# EAGLE design ghettoduino (EAGLE 5.06)
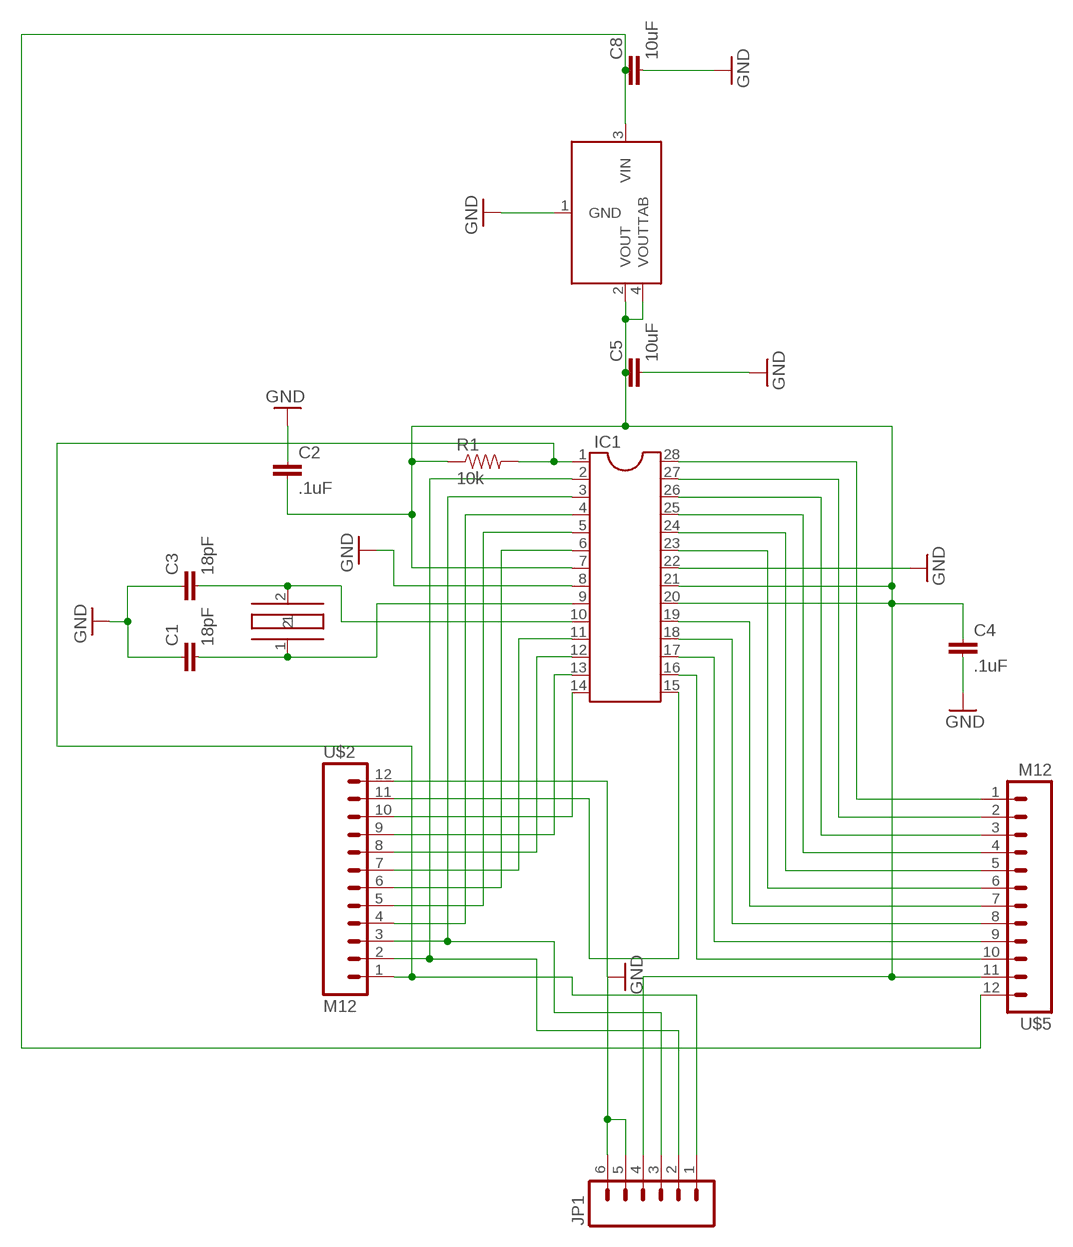
[diagram p0: schematic, sheet 1]

## Parts
5V  ZLDO1117  [ZLDO1117]
C1  18pF  CAP0603-CAP  [0603-CAP]
C2  .1uF  CAP0805  [0805]
C3  18pF  CAP0603-CAP  [0603-CAP]
C4  .1uF  CAP0805  [0805]
C5  10uF  CAP1210  [1210]
C8  10uF  CAP1210  [1210]
IC1  DIL28-3  [DIL28-3]
JP1  M06LOCK  [1X06_LOCK]
R1  10k  RESISTOR  [0805]
U$1  HC49US  [HC49US]
U$2  M12  M12LOCK  [1X12_LOCK]
U$5  M12  M12LOCK  [1X12_LOCK]

## Nets
5V: 5V.2(VOUT) 5V.4(VOUTTAB) C2.2 C4.1 C5.1 IC1.7 IC1.20 IC1.21 JP1.4 R1.1 U$5.11
A0: IC1.23 U$5.6
A1: IC1.24 U$5.5
A2: IC1.25 U$5.4
A3: IC1.26 U$5.3
A4: IC1.27 U$5.2
A5: IC1.28 U$5.1
D0: IC1.2 JP1.2 U$2.2
D1: IC1.3 JP1.3 U$2.3
D2: IC1.4 U$2.4
D3: IC1.5 U$2.5
D4: IC1.6 U$2.6
D5: IC1.11 U$2.7
D6: IC1.12 U$2.8
D7: IC1.13 U$2.9
D8: IC1.14 U$2.10
D9: IC1.15 U$2.11
D10: IC1.16 U$5.10
D11: IC1.17 U$5.9
D12: IC1.18 U$5.8
D13: IC1.19 U$5.7
GND: 5V.1(GND) C1.1 C2.1 C3.1 C4.2 C5.2 C8.2 IC1.8 IC1.22 JP1.5 JP1.6 U$2.12
N$1: C3.2 IC1.10 U$1.2
N$3: C1.2 IC1.9 U$1.1
RESET: IC1.1 JP1.1 R1.2 U$2.1
VIN: 5V.3(VIN) C8.1 U$5.12

## Library data of the parts
5V = 1dah:ZLDO1117
C1-C5 C8 = 1dah:CAP: Capacitor Standard 0402 ceramic capacitor, and 0.1" leaded capacitor.
IC1 = 1dah:DIL28: Dual In Line
JP1 = 1dah:M06: Header 6 Standard 6-pin 0.1" header. Use with straight break away headers (SKU : PRT-00116), right angle break away headers (PRT-00553), swiss pins (PRT-00743), machine pins (PRT-00117), and female headers (PRT-00115). Molex polarized connector foot print use with SKU : PRT-08094 with associated crimp pins and housings. NOTES ON THE VARIANTS LOCK and LOCK_LONGPADS... This footprint was designed to help hold the alignment of a through-hole component (i.e. 6-pin header) while soldering it into place. You may notice that each hole has been shifted either up or down by 0.005 of an inch from it's more standard position (which is a perfectly straight line). This slight alteration caused the pins (the squares in the middle) to touch the edges of the holes. Because they are alternating, it causes a "brace" to hold the component in place. 0.005 has proven to be the perfect amount of "off-center" position when using our standard breakaway headers. Although looks a little odd when you look at the bare footprint, once you have a header in there, the alteration is very hard to notice. Also, if you push a header all the way into place, it is covered up entirely on the bottom side. This idea of altering the position of holes to aid alignment will be further integrated into the Sparkfun Library for other footprints. It can help hold any component with 3 or more connection pins.
R1 = 1dah:RESISTOR: Resistor Basic schematic elements and footprints for 0603, 1206, and PTH 1/10th watt (small) resistors.
U$1 = 1dah:HC49US: 16 MHz crystal
U$2 U$5 = 1dah:M12: Header 12 Standard 12-pin 0.1" header. Use with straight break away headers (SKU : PRT-00116), right angle break away headers (PRT-00553), swiss pins (PRT-00743), machine pins (PRT-00117), and female headers (PRT-00115).

## Board
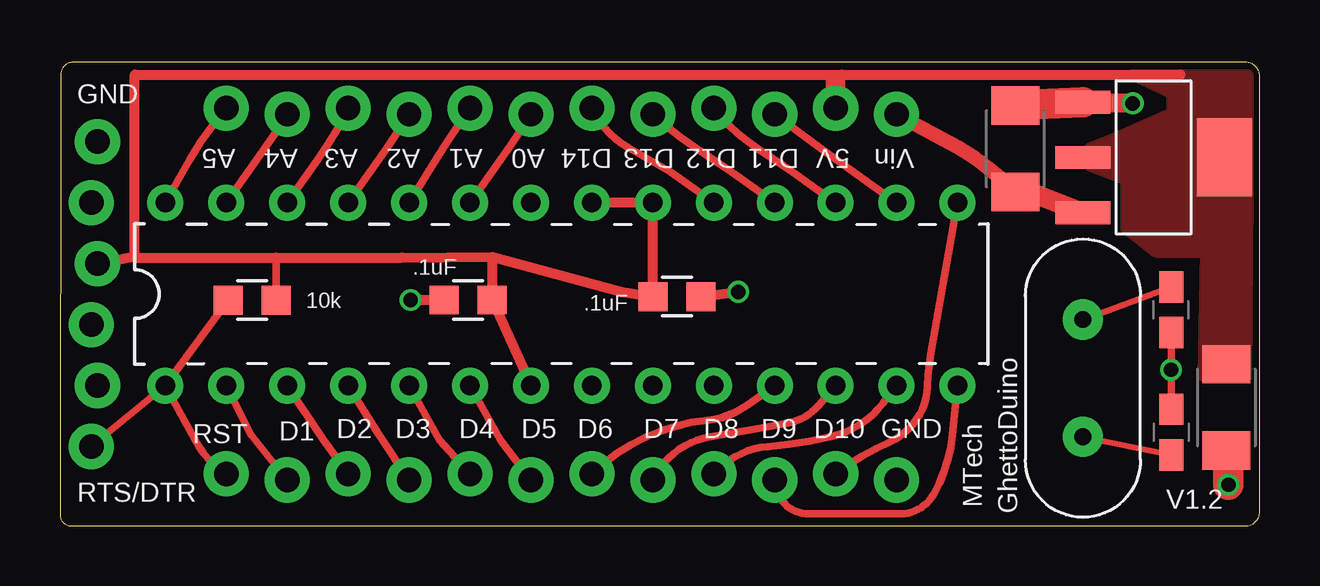
[diagram p1: board, top side]
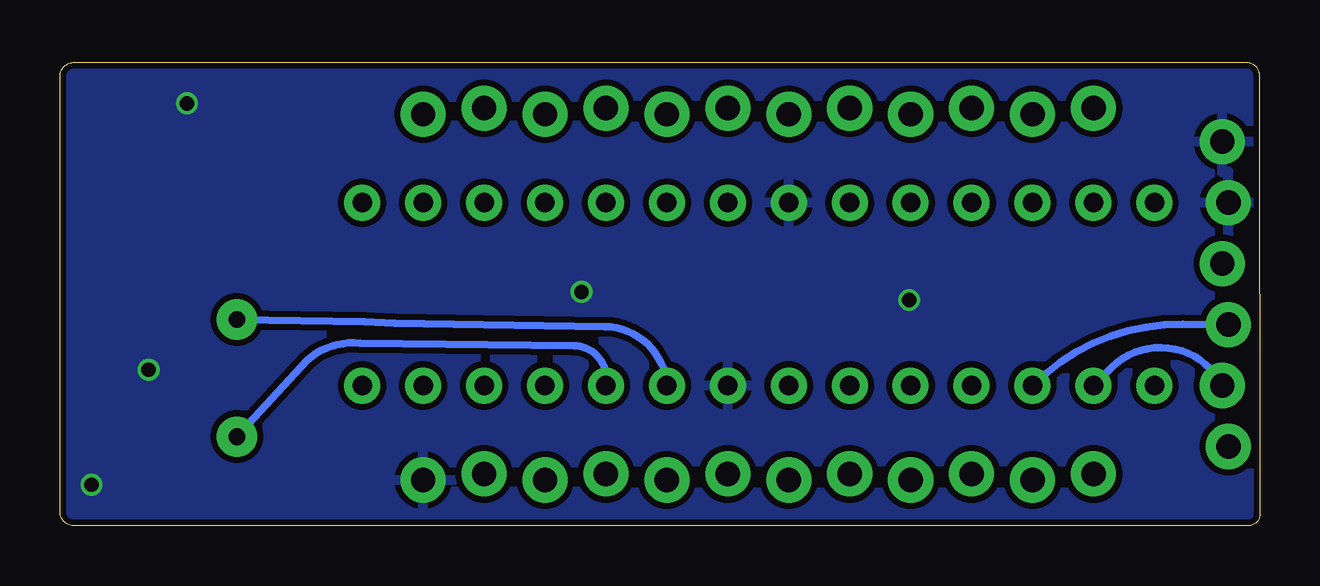
[diagram p2: board, bottom side, seen from below]

Size 50.01 x 19.32 mm. Coordinates in mm from the lower left corner, seen from the top.
Outline: 0.49,19.31 arc87 0.03,18.78 0.01,0.54 arc93 0.41,0.01 49.3,0.01 arc90 50.01,0.52 50.01,18.8 arc90 49.3,19.31 0.49,19.31
Copper layers (1*16): Top 0.035mm / dielectric 1.5mm / Bottom 0.035mm
Design rules "Fusion_eagle_rule_v1.1": minimum track width 6mil, minimum drill 12mil, track to track 6mil, track to pad 6mil, pad to pad 6mil, via to via 6mil, smd to smd 0mil, copper to edge 10mil, drill to drill 10mil, minimum pad ring 10mil, minimum via ring 6mil, stop-mask expansion 2mil, vias tented up to drill 100mil, thermal gap 10mil

### Footprints (pad centres in the part's own frame; a part is rotated, then mirrored left to right if it is on the bottom)
ZLDO1117 = smd 0.95 x 2.3: 1 -2.3,-3; 2 0,-3; 3 2.3,-3 | smd 3.25 x 2.3: 4 0,2.9
0603-CAP = smd 1.3 x 1: 1 -0.95,0; 2 0.95,0
0805 = smd 1.2 x 1.2: 1 -1,0; 2 1,0
1210 = smd 1.6 x 2: 1 -1.8,0; 2 1.8,0
DIL28-3 = drill 0.813 pad 1.5 round: 1 -16.51,-3.81; 2 -13.97,-3.81; 3 -11.43,-3.81; 4 -8.89,-3.81; 5 -6.35,-3.81; 6 -3.81,-3.81; 7 -1.27,-3.81; 8 1.27,-3.81; 9 3.81,-3.81; 10 6.35,-3.81; 11 8.89,-3.81; 12 11.43,-3.81; 13 13.97,-3.81; 14 16.51,-3.81; 15 16.51,3.81; 16 13.97,3.81; 17 11.43,3.81; 18 8.89,3.81; 19 6.35,3.81; 20 3.81,3.81; 21 1.27,3.81; 22 -1.27,3.81; 23 -3.81,3.81; 24 -6.35,3.81; 25 -8.89,3.81; 26 -11.43,3.81; 27 -13.97,3.81; 28 -16.51,3.81
1X06_LOCK = drill 1.016 pad 1.88 round: 1 0,0.127; 2 2.54,-0.127; 3 5.08,0.127; 4 7.62,-0.127; 5 10.16,0.127; 6 12.7,-0.127
HC49US = drill 0.7 pad 1.676 round: 1 -2.44,0; 2 2.44,0
1X12_LOCK = drill 1.016 pad 1.88 round: 1 0,0.127; 2 2.54,-0.127; 3 5.08,0.127; 4 7.62,-0.127; 5 10.16,0.127; 6 12.7,-0.127; 7 15.24,0.127; 8 17.78,-0.127; 9 20.32,0.127; 10 22.86,-0.127; 11 25.4,0.127; 12 27.94,-0.127

### Placement (x,y rotation side)
5V  45.63,15.35 270 top
C1  46.31,9.01 90 top
C2  25.71,9.55 180 top
C3  46.31,3.91 270 top
C4  17.01,9.42 180 top
C5  48.62,4.94 270 top
C8  39.82,15.71 90 top
IC1  20.9,9.66 0 top
JP1  1.44,3.31 90 top
R1  8.01,9.41 180 top
U$1  42.64,6.16 270 top
U$2  6.93,2.04 0 top
U$5  6.93,17.28 0 top

### Tracks (layer width: path | path; a pad name or v marks a point on that pad's centre or on a via)
5V
  Top 0.305: 9.01,11.18 R1.1
  Top 0.406: 3.12,11.18 9.01,11.18 14.25,11.18 18.01,11.21 | 3.12,11.18 3.12,18.8 32.59,18.8 | 32.59,18.8 46.7,18.8 | 18.01,11.21 C4.1 IC1.7 | IC1.21 IC1.20 C2.2 23.41,9.75 18.01,11.21 | JP1.4 3,11.21 3.12,11.18 | 32.59,18.8 arc53 32.33,18.6
  Top 0.813: 32.33,18.6 U$5.11
  pour Top (no thermals): 44.16,16.26 42.89,15.76 42.89,14.99 44.4,14.41 44.4,12.37 45.69,11.38 47.72,11.38 47.62,6.24 49.5,6.24 49.6,18.8 44.66,18.8 46.31,18.01 46.31,17.21
A0
  Top 0.305: IC1.23 18.36,15.25 arc4 U$5.6
A1
  Top 0.305: IC1.24 15.82,15.5 arc-3 U$5.5
A2
  Top 0.305: IC1.25 13.28,15.25 arc4 U$5.4
A3
  Top 0.305: IC1.26 10.74,15.25 arc10 U$5.3
A4
  Top 0.305: IC1.27 8.2,15.25 arc4 U$5.2
A5
  Top 0.305: IC1.28 5.41,15.25 arc-11 U$5.1
D0
  Top 0.305: IC1.2 7.95,3.82 U$2.2
  Bottom 0.305: IC1.2 6.17,6.61 arc107 JP1.2
D1
  Top 0.305: IC1.3 11,3.56 U$2.3
  Bottom 0.305: JP1.3 3.2,8.41 arc-45 IC1.3
D2
  Top 0.305: IC1.4 13.28,3.82 U$2.4
D3
  Top 0.305: IC1.5 15.82,3.56 U$2.5
D4
  Top 0.305: IC1.6 18.36,3.56 U$2.6
D5
  Top 0.305: IC1.11 28.6,5.01 arc-30 27,4.41 arc38 U$2.7
D6
  Top 0.305: IC1.12 31.6,5.01 arc-38 30.4,4.31 arc-2 27.1,3.71 arc55 U$2.8
D7
  Top 0.305: IC1.13 34.3,5.11 arc-40 32.1,3.71 arc-7 29.5,3.31 arc44 U$2.9
D8
  Top 0.305: IC1.14 37.2,3.81 arc-24 36.4,1.31 arc-65 34.9,0.51 31.2,0.51 arc-90 U$2.10
D9
  Top 0.305: IC1.15 36.3,7.21 arc8 36.15,5.81 arc-64 34.6,3.51 arc13 U$2.11
D10
  Top 0.305: IC1.16 33.09,14.74 arc-1 U$5.10
D11
  Top 0.305: IC1.17 30.55,14.74 29.03,15.76 arc-18 U$5.9
D12
  Top 0.305: IC1.18 28.01,14.74 26.49,15.76 arc-9 U$5.8
D13
  Top 0.305: IC1.19 25.47,14.74 23.7,15.76 arc-35 U$5.7
GND  (via drill 0.6)
  Top 0.305: C1.1 v46.31,6.51 C3.1
  Top 0.406: v14.61,9.42 C4.2 | C2.1 v28.27,9.75
  Top 0.813: 5V.1 v44.71,17.61
  Top 1.27: 5V.1 40.2,17.55 C8.2 | C5.2 48.7,2.98 v48.7,1.71
  pour Bottom (isolate 0.254): -5.08,-7.61 62.23,-7.61 62.23,-5.07 62.23,34.3 -5.08,34.3
N$1
  Top 0.254: U$1.2 C3.2
  Bottom 0.305: U$1.2 39.7,6.91 arc49 37.5,7.61 28.6,7.51 arc100 IC1.10
N$3
  Top 0.254: U$1.1 C1.2
  Bottom 0.305: U$1.1 37.3,8.51 arc-4 33.6,8.41 27.3,8.31 arc85 IC1.9
RESET
  Top 0.305: IC1.1 R1.2 | JP1.1 IC1.1 | IC1.1 5.6,3.61 arc29 U$2.1
VIN
  Top 0.61: U$5.12 36.8,16.11 arc-19 C8.1
  Top 0.813: C8.1 40.71,13.81 5V.3

### Text on the board
tPlace: GND | A5 | A4 | A3 | A2 | A1 | A0 | D14 | D13 | D12 | D11 | 5V | Vin | RST | D1 | D2 | D3 | D4 | D5 | D6 | D7 | D8 | D9 | D10 | GND | V1.2 | RTS/DTR | MTech | GhettoDuino